# EAGLE design Adafruit Bluefruit LE SPI Friend (EAGLE 6.4)
AUTHOR: KTOWN
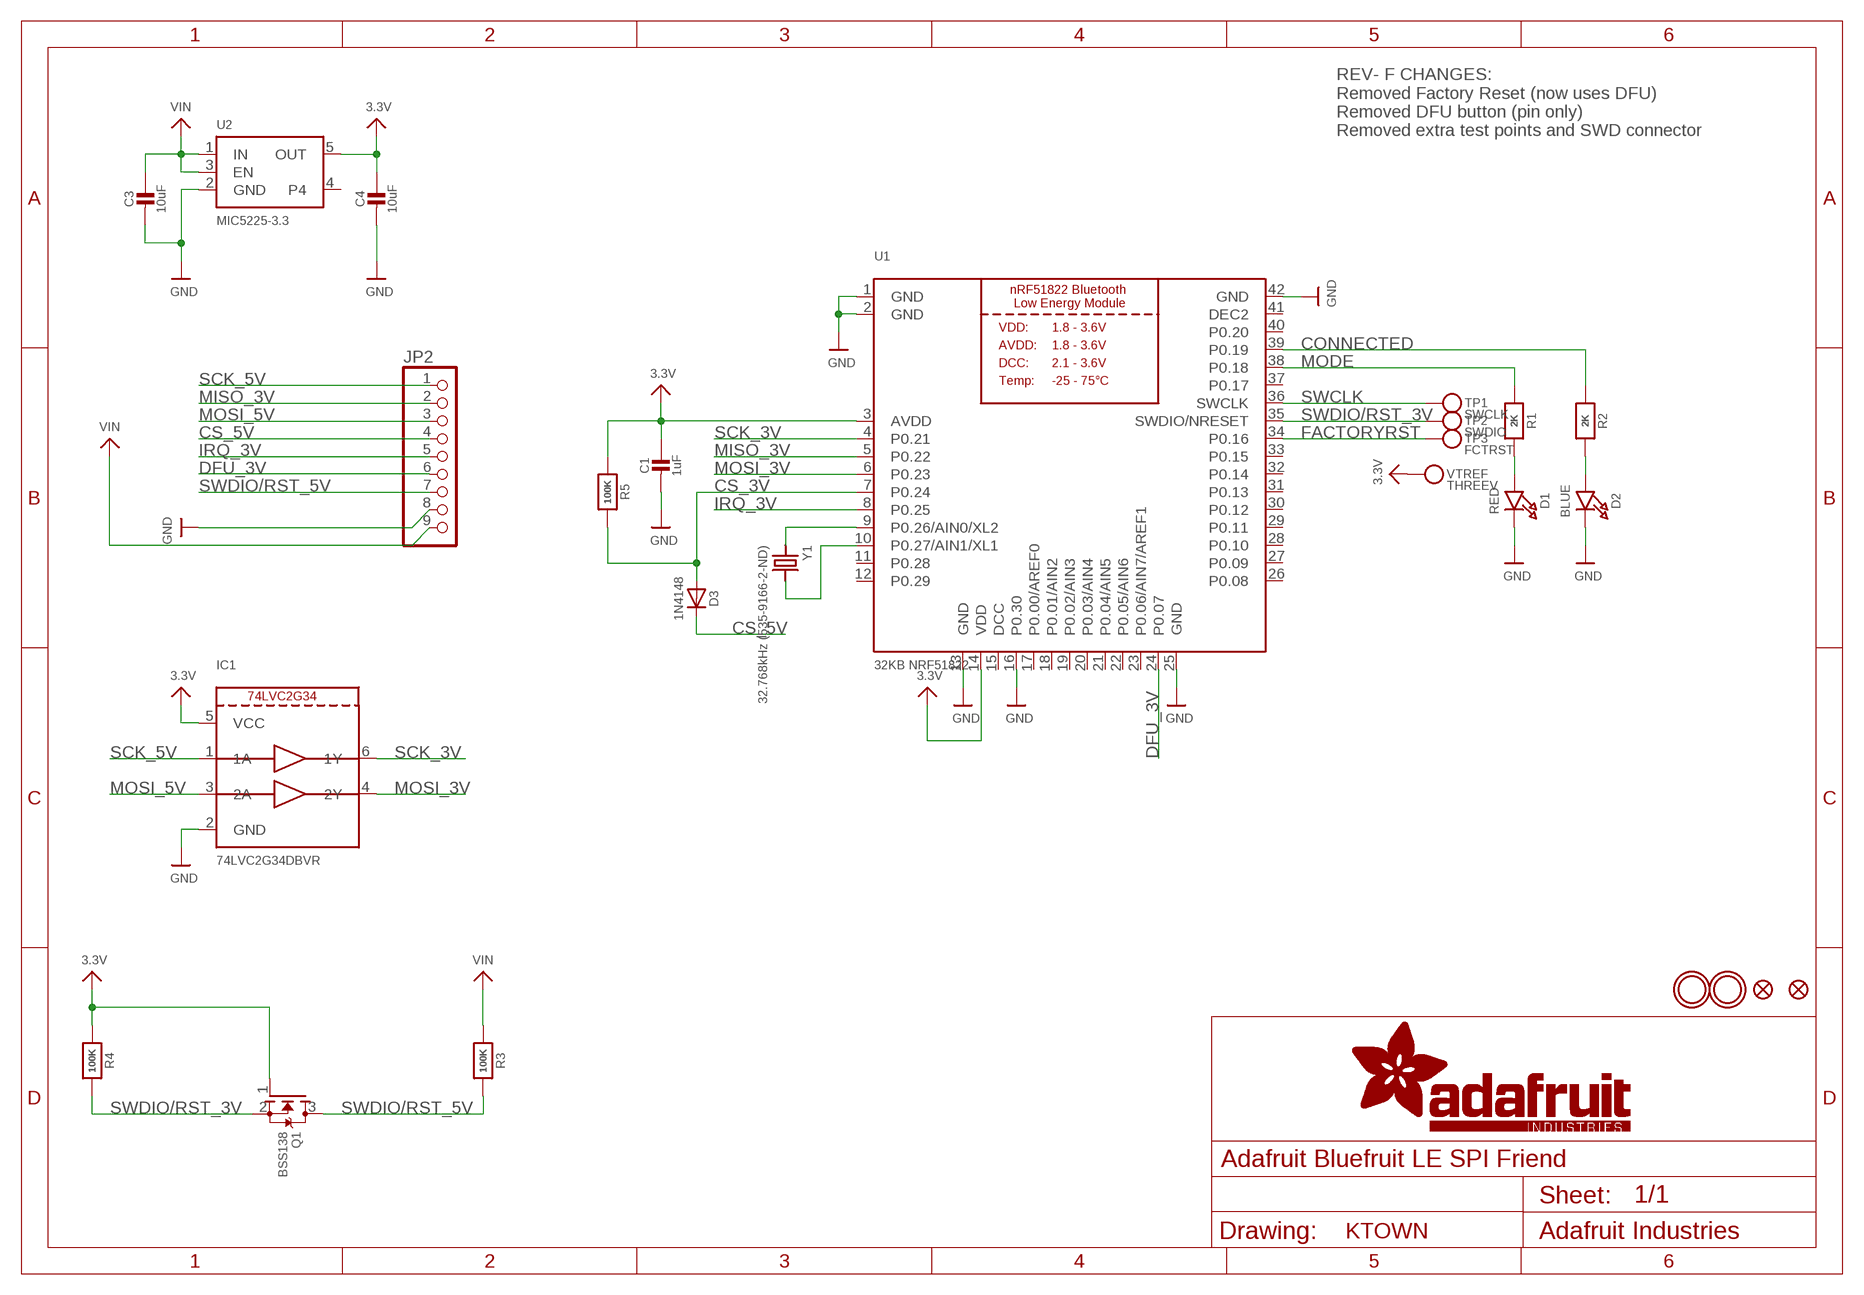
[diagram p0: schematic, sheet 1]

## Parts
C1  1uF  CAP_CERAMIC0805_10MGAP  [0805_10MGAP]
C3  10uF  CAP_CERAMIC0805-NOOUTLINE  [0805-NO]
C4  10uF  CAP_CERAMIC0805_10MGAP  [0805_10MGAP]
D1  RED  LED0805_NOOUTLINE  [CHIPLED_0805_NOOUTLINE]
D2  BLUE  LED0805_NOOUTLINE  [CHIPLED_0805_NOOUTLINE]
D3  1N4148  DIODESOD-323  [SOD-323]
FID1  FIDUCIAL""  [FIDUCIAL_1MM]
FID3  FIDUCIAL""  [FIDUCIAL_1MM]
IC1  74LVC2G34DBVR  [SOT23-6]
JP2  HEADER-1X970MIL  [1X09_ROUND_70]
Q1  BSS138  MOSFET-NWIDE  [SOT23-WIDE@1]
R1  2K  RESISTOR_0805MP  [_0805MP]
R2  2K  RESISTOR_0805MP  [_0805MP]
R3  100K  RESISTOR0805_NOOUTLINE  [0805-NO]
R4  100K  RESISTOR0805_NOOUTLINE  [0805-NO]
R5  100K  RESISTOR_0805MP  [_0805MP]
TP1  SWCLK  TESTPOINT1.5X2.0MM_NOCREAM  [PAD-1.5X2.0]
TP2  SWDIO  TESTPOINT1.5X2.0MM_NOCREAM  [PAD-1.5X2.0]
TP3  FCTRST  TESTPOINT1.5X2.0MM_NOCREAM  [PAD-1.5X2.0]
U1  32KB NRF51822  NRF51822_MODULE_MDBT40  [BLE_MODULE_RAYTAC_MDBT40]
U2  MIC5225-3.3  VREG_SOT23-5  [SOT23-5]
U$28  MOUNTINGHOLE2.5  [MOUNTINGHOLE_2.5_PLATED]
U$29  MOUNTINGHOLE2.5  [MOUNTINGHOLE_2.5_PLATED]
VTREF  THREEV  TESTPOINT1.5X2.0MM_NOCREAM  [PAD-1.5X2.0]
Y1  32.768kHz (535-9166-2-ND)  CRYSTAL2.0X6.0_32.768  [CRYSTAL_CYL_2X6MM_SMT]

## Nets
3.3V: C1.1 C4.1 IC1.5(VCC) Q1.1(G) R4.1 R5.1 U1.3(AVDD) U1.14(VDD) U2.5(OUT) VTREF.P$1
CONNECTED: R2.1 U1.39(P0.19)
CS_3V: D3.A R5.2 U1.7(P0.24)
CS_5V: D3.C JP2.4
DFU_3V: JP2.6 U1.24(P0.07)
FACTORYRST: TP3.P$1 U1.34(P0.16)
GND: C1.2 C3.2 C4.2 D1.C D2.C IC1.2(GND) JP2.8 U1.1(GND) U1.2(GND) U1.13(GND) U1.16(P0.30) U1.25(GND) U1.42(GND) U2.2(GND)
IRQ_3V: JP2.5 U1.8(P0.25)
MISO_3V: JP2.2 U1.5(P0.22)
MODE: R1.1 U1.38(P0.18)
MOSI_3V: IC1.4(2Y) U1.6(P0.23)
MOSI_5V: IC1.3(2A) JP2.3
N$1: U1.9(P0.26/AIN0/XL2) Y1.1
N$2: U1.10(P0.27/AIN1/XL1) Y1.2
N$5: D1.A R1.2
N$6: D2.A R2.2
SCK_3V: IC1.6(1Y) U1.4(P0.21)
SCK_5V: IC1.1(1A) JP2.1
SWCLK: TP1.P$1 U1.36(SWCLK)
SWDIO/RST_3V: Q1.2(S) R4.2 TP2.P$1 U1.35(SWDIO/NRESET)
SWDIO/RST_5V: JP2.7 Q1.3(D) R3.2
VIN: C3.1 JP2.9 R3.1 U2.1(IN) U2.3(EN)
Unconnected: U1.11(P0.28) U1.12(P0.29) U1.17(P0.00/AREF0) U1.18(P0.01/AIN2) U1.19(P0.02/AIN3) U1.20(P0.03/AIN4) U1.21(P0.04/AIN5) U1.22(P0.05/AIN6) U1.23(P0.06/AIN7/AREF1) U1.26(P0.08) U1.27(P0.09) U1.28(P0.10) U1.29(P0.11) U1.30(P0.12) U1.31(P0.13) U1.32(P0.14) U1.33(P0.15) U1.37(P0.17) U1.40(P0.20) U2.4

## Notes on the sheet
- REV- F CHANGES:
  Removed Factory Reset (now uses DFU)
  Removed DFU button (pin only)
  Removed extra test points and SWD connector

## Power pins joined to a net without a drawn wire
DCC: U1.15(DCC)
DEC2: U1.41(DEC2)

## Library data of the parts
C1 C3 C4 = microbuilder:CAP_CERAMIC: Ceramic Capacitors For new designs, use the packages preceded by an '_' character since they are more reliable: The following footprints should be used on most boards: _0402 - Standard footprint for regular board layouts _0603 - Standard footprint for regular board layouts _0805 - Standard footprint for regular board layouts _1206 - Standard footprint for regular board layouts For extremely tight-pitch boards where space is at a premium, the following 'micro-pitch' footprints can be used (smaller pads, no silkscreen outline, etc.): _0402MP - Micro-pitch footprint for very dense/compact boards _0603MP - Micro-pitch footprint for very dense/compact boards _0805MP - Micro-pitch footprint for very dense/compact boards _1206MP - Micro-pitch footprint for very dense/compact boards
D1 D2 = microbuilder:LED: LED 0603 - 0603 Surface Mount Package 2mA: Green LED - Low Power (3.9mcd, 2ma, 1.7Vf) - Digikey: 475-2709-2-ND Orange LED - Low Power (9.8mcd, 2ma, 1.8Vf) - Digikey: 475-1194-2-ND Red LED - Low Power (5mcd, 2ma, 1.8Vf) - Digikey: 475-1195-2-ND Yellow LED - Low Power (7mcd, 2ma, 1.8Vf) - Digikey: 475-1196-2-ND 5mA: Blue LED - Low Power (17mcd, 5ma, 2.9Vf) - Digikey: LNJ937W8CRACT-ND 0805 - 0805 Surface Mount Package 2mA: Red LED (8.8mcd, 2mA, 1.8Vf, Clear) - Low Power [Digikey: 475-2510-1-ND] Green LED (5mcd, 2mA, 1.8Vf, Clear) - Low Power [Digikey: 475-2730-1-ND] Yellow LED (11.3mcd, 2mA, 1.8Vf, Clear) - Low Power [Digikey: 475-2555-1-ND] 20mA: Red LED (104mcd, 20mA, Diffused) - LS R976 [Digikey: 475-1278-6-ND] Red LED (12mcd, 20mA, 2.0Vf, Clear) - APT2012EC [Digikey: 754-1128-1-ND] Green LED (15mcd, 20mA, 2.2Vf, Clear) - APT2012GC [Digikey: 754-1131-1-ND] Orange LED (160mcd, 20mA, 2.1Vf, Clear) - APT2012SECK [Digikey: 754-1130-1-ND] 1206 - 1206 Surface Mount Package Green LED (26mcd, 20mA, Diffused) - LG N971 [Digikey: 475-1407-6-ND] Red LED (15mcd, 20mA, Diffused) - LH N974 [Digikey: 475-1416-6-ND] Cree - Cree High-Power Surface Mount LEDs XPEBWT-L1-0000-00D50 - White 111lm 350mA 2.9Vf 6200K 110° XTEAWT-00-0000-00000LEE3 - White 114lm 350mA 2.85Vf 5000K 115° Everlight - Everlight 45-21 Series Surface Mount LEDs 45-21/QK2C-B2832AC2CB2/2T - Warm White 2000mcd 20mA 3.25Vf 3050K 120° 45-21/LK2C-B38452C4CB2/2T - Nuetral White 2000mcd 20mA 3.25Vf 4150K 120° 45-21/LK2C-B50634C6CB2/2T - Cold White 2200mcd 20mA 3.25Vf 5650K 120° PLCC2 Reverse Mount LS T77K-J1L2-1-0-2-R18-Z - Red 11.25mcd 2mA 1.8Vf 630nm 120° LO T77K-L1M2-24-Z - Orange 19.6mcd 2mA 1.8Vf 606nm 120° LY T77K-K2M1-26-Z - Yellow 15.7mcd 2mA 1.8Vf 587nm 120°
D3 = microbuilder:DIODE: Diode SMA Model Volts Amps Type Vf Ir Digikey # Notes SSA34-E3 40V 3A Schottky 480mV @ 3A 200uA @ 40V SSA34-E3/61TGITR-ND CDBA120-G 20V 1A Schottky 500mV @ 1A 500uA @ 20V 641-1014-6-ND REEL MBRA210 10V 2A Schottky 350mV @ 2A 700uA @ 10V MBRA210LT3 SOD-123 Model Volts Amps Type Vf Ir Order # Notes BAT54T1G 30V 200mA Schottky 800mV @ 200mA 2uA @ 25V BAT54T1GOSTR-ND B0530W 30V 500mA Schottky 430mV @ 500mA 130uA @ 30V B0530W-FDICT-ND REEL MBR120 20V 1A Schottky 340mV @ 1A MBR120VLSFT1GOSCT-ND SOD-323 Model Volts Amps Type Vf Ir Order # Notes PMEG2005EJ 20V 500mA Schottky 355mV @ 500mA 568-4110-1-ND ZLLS410 10V 570mA Schottky 380mV @ 570mA ZLLS410CT-ND 1N4148WS 75V 150mA Silicon/Simple 1V 1N4148WSFSCT-ND REEL SOD-523 Model Volts Amps Type Vf Ir Order # Notes BAT54XV2 30V 200mA Schottky 0.8V @ 100mA BAT54XV2CT-ND TB751S 30V 30mA Schottky RB751S-40TE61CT-ND SOT23-R/W (R = Solder Paste/Reflow Ovens, W = Hand-Soldering) Model Volts Amps Type Vf Ir Order # Notes BAT54FILM 40V 300mA Schottky 497-7162-1-ND POWERDI-5 Model Volts Amps Type Vf Ir Order # Notes PDS560 60V 5A Schottky 670mV @ 5A 150uA @ 60V PDS560DICT-ND
FID1 FID3 = microbuilder:FIDUCIAL: Fiducial Alignment Points Various fiducial points for machine vision alignment.; BOM: EXCLUDE
IC1 = microbuilder:74LVC2G34
JP2 = microbuilder:HEADER-1X9: PIN HEADER
Q1 = microbuilder:MOSFET-N: N-Channel Mosfet LEGEND VDS: Voltage Drain-Source ID: Drain Current RDS(ON): Drain-Source On-State Resistance VGS(TH): Gate-Source Threshold Voltage CISS: Drain-Source Input Capacitance SOT-23 Name VDS ID RDS(ON) VGS(TH) CISS Order Number 2N7002E 60V 260mA 2.5 Ohm 2.5V @ 250uA 26.7pF @ 25V 2N7002ET1GOSTR-ND BSH103 30V 850mA 400 mOhm 400mV @ 1mA 83pF @ 24V BSH103,235-ND BSS138 60V 320mA 1.6 Ohm 1.5V @ 250uA 50pF @ 10V Mouser: 771-BSS138PW115 DMN2075U-7 20V 4.2A 38 mOhm 1V @ 250 uA 594.3pF @ 10V DMN2075U-7DICT-ND * BSS138 good choice for I2C level-shifting
R1-R5 = microbuilder:RESISTOR: Resistors For new designs, use the packages preceded by an '_' character since they are more reliable: The following footprints should be used on most boards: _0402 - Standard footprint for regular board layouts _0603 - Standard footprint for regular board layouts _0805 - Standard footprint for regular board layouts _1206 - Standard footprint for regular board layouts For extremely tight-pitch boards where space is at a premium, the following 'micro-pitch' footprints can be used (smaller pads, no silkscreen outline, etc.): _0402MP - Micro-pitch footprint for very dense/compact boards _0603MP - Micro-pitch footprint for very dense/compact boards _0805MP - Micro-pitch footprint for very dense/compact boards _1206MP - Micro-pitch footprint for very dense/compact boards
TP1-TP3 VTREF = microbuilder:TESTPOINT: Test Point Various test points for characterisation and PCB testing TESTPOINT_SMT - Compact Surface Mount Test Point [Digikey: 5016KTR-ND]
U1 = microbuilder:NRF51822_MODULE_MDBT40: nRF51822 Bluetooth Low Energy Module
U2 = microbuilder:VREG_SOT23-5: SOT23-5 Fixed Voltage Regulators Part Current Out V Out V In V Dropout θJA (°C/W) TJ (°C) Digikey Part No. ADP121 150mA 3.3V 3.4-5.5V 0.09V @ 150mA -- -- ADP121-AUJZ33R7CT-ND ADP121 150mA 3.0V 3.1-5.5V 0.09V @ 150mA -- -- ADP121-AUJZ30R7CT-ND ADP122 300mA 3.3V 3.4-5.5V 0.085V @ 300mA -- -- ADP122AUJZ-3.3-R7CT-ND ADP1712 300mA 3.3V 3.5-5.5V 0.17V @ 300mA -- -- ADP1712AUJZ-3.3-R7TR-ND AP7311 (Low Cost) 150mA 3.3V 3.5-6V 0.15V @ 150mA -- -- AP7311-33WG-7DICT-ND LD39015M18R 150mA 1.8V 1.9V-5.5V 0.08V @ 100mA -- -- 497-6977-1-ND LP2985A-33DBVR 150mA 3.3V 3.3-16V 0.28V @ 150mA 206 150 296-18479-1-ND MCP1824T-3302E/OT 300mA 3.3V 3.5V-6V 0.2V @ 300mA -- -- MCP1824T-3302E/OTCT-ND MIC5205-2.5YM5 TR 150mA 2.5V 2.7-16V 0.165V @ 150mA -- -- 576-1257-2-ND MIC5205-3.0YM5 TR 150mA 3.0V 3.2V-16V 0.165V @ 150mA -- -- 576-1258-2-ND MIC5205-3.3YM5 TR 150mA 3.3V 3.5V-16V 0.165V @ 150mA -- -- 576-1259-2-ND TPS780330220 150mA 3.3V+2.2V 3.6-5.5V 250mV Max -- -- 296-23332-1-ND TDA3663/N1,135 100mA 3.3V 3.5-45V 0.18V @ 50mA -- -- 568-5343-1-ND Max operating temp can be calculated using θJA, TJ (max junction temperature), and power in watts. Set the "Maximum Ambient Temperature" until it reaches TJ ("Max Junction Temperature"), which is the absolute limit for safe use of the regulator: Heat Sink Temperature Calculator <http://www.daycounter.com/Calculators/Heat-Sink-Temperature-Calculator.phtml> For example, With 12V source into a 3.3V LP2985 and a 30mA load, we are dissipating (12V-3.3V) * 0.03A = 0.261W. With a θJA of 206 °C/W, a TJ of 150°C, and 261mW we can safely use the chip without a heat sink up to 75°C (=147.1°C Junction Temperature).
U$28 U$29 = microbuilder:MOUNTINGHOLE: Mounting Hole For #2 screws (0.086"/2.18mm width, 0.094"/2.4mm hole) use 2.5mm; BOM: EXCLUDE
Y1 = microbuilder:CRYSTAL: Crystals HC49UP - Surface Mount Crystal 4.0MHz 18pF +/-30ppm Surface Mount Crystal [Digikey: 535-9857-1-ND] 12.0 MHz Surface Mount Crystal [Digikey: 535-9869-6-ND] 25.0 MHz Surface Mount Crystal [Digikey: 535-9078-1-ND] 2.5 x 2.0mm - MEMs SMT Crystal 16.0 MHz 10pF 20ppm 2.5 x 2.0mm Crystal [Digikey -40-85°C: 535-10923-1-ND] 3.2 x 2.5mm - MEMs SMT Crystal 12.0 MHz 8pF 15ppm 3.2 x 2.5mm Crystal [Digikey: -10-70°C: 644-1047-1-ND -40-125°C: 644-1128-1-ND] 40~85°C cheaper: 644-1173-6-ND 16.0 MHz 8pF 15ppm 3.2 x 2.5mm Crystal [Digikey: -10-70°C: 644-1049-1-ND -40-125°C: 644-1129-2-ND]-40~85°C cheaper: 644-1175-6-ND 16.0 MHz 10pF 10ppm 3.2 x 2.5mm Crystal [Digikey: 644-1100-1-ND] 27.12 MHz 18pF 30ppm 3.2 x 2.5mm Crystal [Digikey: 887-1424-1-ND] 27.12MHz 10pF 10ppm 3.2 x 2.5mm Crystal [Digikey: 887-1329-1-ND] 4.9 x 1.8mm - MEMs SMT Crystal 32.768 KHz 12.5pF 20ppm 4.9 x 1.8mm Crystal [Digikey: SE2415CT-ND] 8.0 x 3.8mm - Surface Mount Crystal 32.768kHz 12.5pF 20ppm -40°C-85°C [Digikey: 535-9166-2-ND] Cylinder 32.768KHz Cylinder Crystal (2x6mm body) [Ex. Digikey: 300-8341-2-ND]

## Board
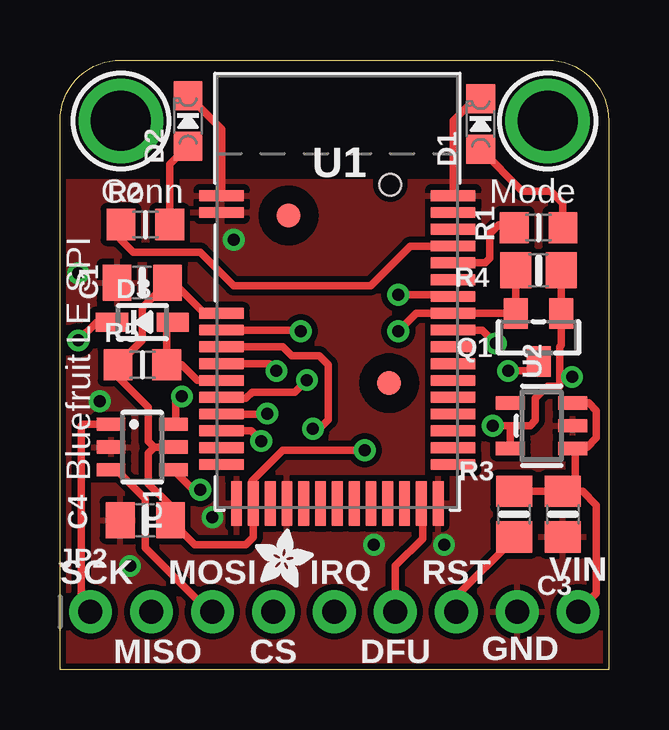
[diagram p1: board, top side]
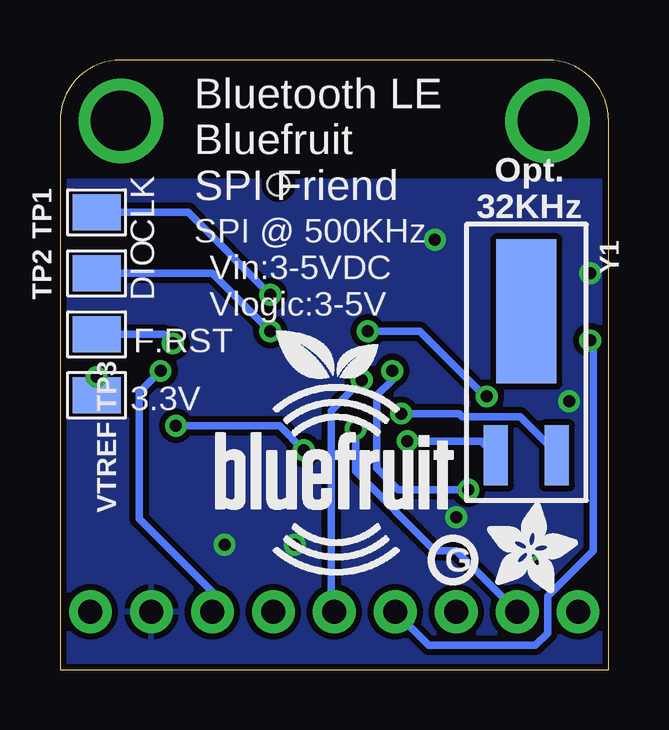
[diagram p2: board, bottom side, seen from below]

Size 22.86 x 25.4 mm. Coordinates in mm from the lower left corner, seen from the top.
Outline: 2.54,25.4 20.32,25.4 arc-90 22.86,22.86 22.86,0 0,0 0,22.86 arc-90 2.54,25.4
Copper layers (1*16): Top 0.035mm / dielectric 1.5mm / Bottom 0.035mm
Design rules "adafruit *": minimum track width 8mil, minimum drill 15.5mil, track to track 8mil, track to pad 8mil, pad to pad 8mil, via to via 8mil, smd to smd 8mil, copper to edge 10mil, drill to drill 8mil, minimum pad ring 10mil, minimum via ring 8mil, stop-mask expansion 2mil, vias tented up to drill 20mil, thermal gap 10mil
tRestrict: area 7.6,21.1 to 18,24.6
bRestrict: area 7.6,21.1 to 18,24.6

### Footprints (pad centres in the part's own frame; a part is rotated, then mirrored left to right if it is on the bottom)
0805_10MGAP = smd 1.2 x 1.5: 1 -1.05,0; 2 1.05,0
0805-NO = smd 1.3 x 1.5: 1 -0.95,0; 2 0.95,0
CHIPLED_0805_NOOUTLINE = smd 1.2 x 1.2: A 0,-1.05; C 0,1.05
SOD-323 = smd 1.35 x 0.8: A 1.27,0; C -1.27,0
FIDUCIAL_1MM = smd 1 x 1: 1 0,0
SOT23-6 = smd 0.55 x 1.2: 1 -0.95,-1.3; 2 0,-1.3; 3 0.95,-1.3; 4 0.95,1.3; 5 0,1.3; 6 -0.95,1.3
1X09_ROUND_70 = drill 1 pad 1.778: 1 -10.16,0; 2 -7.62,0; 3 -5.08,0; 4 -2.54,0; 5 0,0; 6 2.54,0; 7 5.08,0; 8 7.62,0; 9 10.16,0
SOT23-WIDE@1 = smd 1 x 1.27: 1 -0.95,-1; 2 0.95,-1; 3 0,1
_0805MP = smd 1.2 x 1.3: 1 -1.016,0; 2 1.016,0
PAD-1.5X2.0 = smd 1.5 x 2: P$1 0,0
BLE_MODULE_RAYTAC_MDBT40 = smd 1.85 x 0.45: 1 -4.825,4; 2 -4.825,3.3; 3 -4.825,-0.9; 4 -4.825,-1.6; 5 -4.825,-2.3; 6 -4.825,-3; 7 -4.825,-3.7; 8 -4.825,-4.4; 9 -4.825,-5.1; 10 -4.825,-5.8; 11 -4.825,-6.5; 12 -4.825,-7.2; 26 4.825,-7.2; 27 4.825,-6.5; 28 4.825,-5.8; 29 4.825,-5.1; 30 4.825,-4.4; 31 4.825,-3.7; 32 4.825,-3; 33 4.825,-2.3; 34 4.825,-1.6; 35 4.825,-0.9; 36 4.825,-0.2; 37 4.825,0.5; 38 4.825,1.2; 39 4.825,1.9; 40 4.825,2.6; 41 4.825,3.3; 42 4.825,4 | smd 0.45 x 1.85: 13 -4.2,-8.825; 14 -3.5,-8.825; 15 -2.8,-8.825; 16 -2.1,-8.825; 17 -1.4,-8.825; 18 -0.7,-8.825; 19 0,-8.825; 20 0.7,-8.825; 21 1.4,-8.825; 22 2.1,-8.825; 23 2.8,-8.825; 24 3.5,-8.825; 25 4.2,-8.825 | hole 0.9: 2.2,4.45
SOT23-5 = smd 0.55 x 1.2: 1 -0.95,-1.3; 2 0,-1.3; 3 0.95,-1.3; 4 0.95,1.3; 5 -0.95,1.3
MOUNTINGHOLE_2.5_PLATED = drill 2.5 pad 3.2: P$1 0,0
CRYSTAL_CYL_2X6MM_SMT = smd 2.5 x 1: 1 2.125,1.27; 2 2.125,-1.27 | smd 6 x 2.5: CYLINDER -3.875,0

### Placement (x,y rotation side)
C1  3.43,16.13 180 top
C3  20.95,6.48 270 top
C4  3.56,6.22 180 top
D1  17.53,22.73 0 top
D2  5.33,22.86 0 top
D3  3.43,14.48 0 top
FID1  13.72,11.94 0 top
FID3  9.53,18.92 0 top
IC1  3.43,9.27 270 top
JP2  11.43,2.41 0 top
Q1  19.94,13.84 180 top
R1  19.94,18.41 0 top
R2  3.56,18.54 0 top
R3  18.92,6.48 270 top
R4  19.94,16.64 180 top
R5  3.43,12.7 0 top
TP1  21.34,19.05 90 bottom
TP2  21.34,16.51 90 bottom
TP3  21.34,13.97 270 bottom
U1  11.56,15.75 0 top
U2  20.07,10.16 90 top
U$3  [ADAFRUIT_2.5MM]  8.13,3.43 0 top
U$9  [BLUEFRUITLOGO_100MM]  16.38,3.94 0 bottom
U$17  [ADAFRUIT_3.5MM]  5.08,3.17 0 bottom
U$18  [PCBFEAT-REV-040]  6.48,4.57 0 bottom
U$28  20.32,22.86 0 top
U$29  2.54,22.86 0 top
VTREF  21.34,11.43 270 bottom
Y1  3.43,11.05 270 bottom

### Tracks (layer width: path | path; a pad name or v marks a point on that pad's centre or on a via)
3.3V  (via drill 0.5)
  Top 0.305: U1.3 6.01,14.85 4.73,16.13 C1.1 3.43,15.08 3.43,13.72 R5.1 2.41,12.19 3.68,10.92 3.68,9.53 3.94,9.27 | R4.1 Q1.1 | 18.8,9.24 U2.5 18.77,10.06 18.67,10.16 | 21.21,14.35 20.89,14.67 Q1.1 | 20.83,12.06 20.83,11.81 20.32,11.81 19.81,11.3 19.81,10.38 19.59,10.16 18.67,10.16 | 20.83,12.06 20.83,13.46 20.89,13.52 Q1.1 | 3.94,9.27 3.68,9.02 3.68,7.75 4.61,6.82 C4.1 5.62,5.21 7.75,5.21 8.06,5.52 U1.14 8,6.98 8,7.87 9.27,9.14 v12.7,9.14 | 3.94,9.27 IC1.5 | v21.34,12.19 20.95,12.19 20.83,12.06 | 18.67,10.16 v18.03,10.16
  Bottom 0.305: v18.03,10.16 13.71,10.16 v12.7,9.14 | VTREF.P$1 v21.34,12.19
CONNECTED
  Top 0.305: U1.39 14.6,17.65 12.95,16 7.24,16 5.84,17.4 3.05,17.4 2.54,17.91 R2.1
CS_3V
  Top 0.305: D3.A 4.45,14.22 R5.2 5.08,12.7 5.71,12.06 6.71,12.06 U1.7
CS_5V  (via drill 0.5)
  Top 0.305: v0.76,13.72 1.52,14.48 D3.C
  Bottom 0.305: v0.76,13.72 0.64,13.59 0.64,4.95 2.54,3.05 2.54,1.52 3.05,1.02 7.49,1.02 JP2.4
DFU_3V
  Top 0.305: JP2.6 13.97,4.32 15.11,5.46 15.11,6.87 U1.24
FACTORYRST  (via drill 0.5)
  Top 0.305: v18.16,13.59 17.6,14.15 U1.34
  Bottom 0.305: TP3.P$1 18.54,13.97 v18.16,13.59
GND  (via drill 0.5)
  Top 0.305: D1.C 17.31,23.78 16.38,22.86 U1.42 | D2.C 6.73,22.51 U1.1
  other vias: 16,5.21 13.08,5.21 7.24,17.91 0.76,16.51 2.92,4.32 6.35,6.35 1.65,11.18
  pour Top (isolate 0.254): 22.86,20.32 22.86,0 0,0 0,20.32
  pour Bottom (isolate 0.254): 22.86,20.32 22.86,0 0,0 0,20.32
IRQ_3V  (via drill 0.5)
  Top 0.305: 10.54,12.06 v10.29,12.06 9.78,11.56 8,11.56 7.75,11.3 6.78,11.3 U1.8
  Bottom 0.305: v10.29,12.06 11.56,10.79 11.56,2.41 JP2.5
MISO_3V  (via drill 0.5)
  Top 0.305: U1.5 9.29,13.45 9.65,13.08 10.79,13.08 11.18,12.7 11.18,10.41 10.79,10.03 v10.54,10.03
  Bottom 0.305: v10.54,10.03 10.54,8.26 7.24,4.95 6.35,4.95 JP2.2
MODE
  Top 0.305: U1.38 17.71,16.95 17.91,17.14 17.91,18.16 18.29,18.54 18.8,18.54 R1.1
MOSI_3V  (via drill 0.5)
  Top 0.305: U1.6 8.71,12.75 v9.02,12.45 | v5.84,7.49 5.56,7.49 IC1.4
  Bottom 0.305: v9.02,12.45 9.02,12.06 9.65,11.43 9.65,8.38 8.76,7.49 v5.84,7.49
MOSI_5V
  Top 0.305: IC1.3 2.35,8.32 3.56,7.11 3.56,5.08 6.22,2.41 JP2.3
N$1  (via drill 0.5)
  Top 0.305: U1.9 8.53,10.65 8.55,10.67 v8.64,10.67
  Bottom 0.305: v8.64,10.67 6.22,10.67 6.1,10.54 3.68,10.54 2.16,9.02 Y1.1
N$2  (via drill 0.5)
  Top 0.305: v8.38,9.53 7.96,9.95 U1.10
  Bottom 0.305: v8.38,9.53 5.3,9.53 Y1.2
N$5
  Top 0.305: D1.A 19.27,19.94 20.45,19.94 20.95,19.43 R1.2
N$6
  Top 0.305: D2.A 4.57,21.05 R2.2
SCK_3V  (via drill 0.5)
  Top 0.305: IC1.6 4.83,10.32 4.83,11.12 v5.08,11.38 | U1.4 9.86,14.15 9.91,14.1 v10.03,14.1
  Bottom 0.305: v10.03,14.1 7.87,14.1 5.16,11.38 v5.08,11.38
SCK_5V
  Top 0.305: JP2.1 0.89,2.79 0.89,10.16 0.95,10.22 IC1.1
SWCLK  (via drill 0.5)
  Top 0.305: v14.1,15.62 16.31,15.62 U1.36
  Bottom 0.305: TP1.P$1 17.53,19.05 v14.1,15.62
SWDIO/RST_3V  (via drill 0.5)
  Top 0.305: R4.2 Q1.2 U1.35 14.85,14.85 v14.1,14.1
  Bottom 0.305: TP2.P$1 16.51,16.51 v14.1,14.1
SWDIO/RST_5V  (via drill 0.5)
  Top 0.305: JP2.7 16.51,2.99 16.51,3.05 18.92,5.46 R3.2 | Q1.3 19.54,12.45 v18.67,12.45
  Bottom 0.305: JP2.7 16.51,3.24 19.56,6.29 19.56,11.56 v18.67,12.45
VIN
  Top 0.305: JP2.9 22.35,3.17 22.35,6.86 21.78,7.43 21.46,7.43 | R3.1 C3.1 21.46,7.43 | 21.38,9.06 21.17,9.27 21.97,9.27 22.35,9.65 22.35,10.79 22.04,11.11 U2.3 | 21.38,9.06 21.46,8.98 21.46,7.43 | U2.1 21.38,9.2 21.38,9.06

### Text on the board
tPlace: Conn | Mode | Bluefruit LE SPI | SCK | MOSI | IRQ | RST | VIN | MISO | CS | DFU | GND
bPlace: Bluetooth LE | Opt. / 32KHz | Bluefruit / SPI Friend | SPI @ 500KHz | CLK | Vin:3-5VDC | Vlogic:3-5V | DIO | F.RST | 3.3V